# EAGLE schematic MagBase (EAGLE 7.1.0)
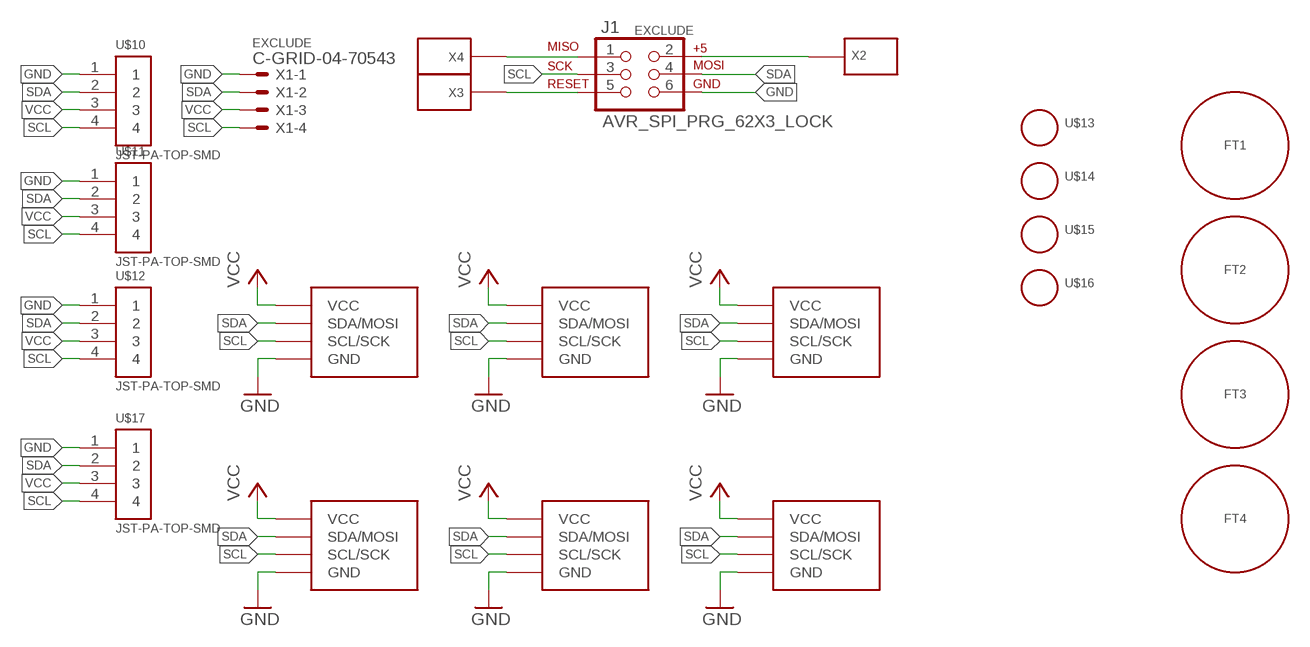
[diagram p0: schematic, sheet 1]

## Parts
FT1  FOOT  [FOOT]
FT2  FOOT  [FOOT]
FT3  FOOT  [FOOT]
FT4  FOOT  [FOOT]
J1  AVR_SPI_PRG_62X3_LOCK  [2X3_LOCK]
U$1  MAGBASE  [MAGBASE]
U$2  MAGBASE  [MAGBASE]
U$3  MAGBASE  [MAGBASE]
U$4  MAGBASE  [MAGBASE]
U$5  MAGBASE  [MAGBASE]
U$6  MAGBASE  [MAGBASE]
U$10  JST-PA-TOP-SMD  [JST-PA-TOP-SMD]
U$11  JST-PA-TOP-SMD  [JST-PA-TOP-SMD]
U$12  JST-PA-TOP-SMD  [JST-PA-TOP-SMD]
U$13  HOLE#4  [HOLE-#4]
U$14  HOLE#4  [HOLE-#4]
U$15  HOLE#4  [HOLE-#4]
U$16  HOLE#4  [HOLE-#4]
U$17  JST-PA-TOP-SMD  [JST-PA-TOP-SMD]
X1  C-GRID-04-70543  [70543-04]
X2  SPRING-CONTACT  [SPRING-CONTACT]
X3  SPRING-CONTACT  [SPRING-CONTACT]
X4  SPRING-CONTACT  [SPRING-CONTACT]

## Nets
GND: J1.6 U$1.GNDA(GND) U$1.GNDB(GND) U$2.GNDA(GND) U$2.GNDB(GND) U$3.GNDA(GND) U$3.GNDB(GND) U$4.GNDA(GND) U$4.GNDB(GND) U$5.GNDA(GND) U$5.GNDB(GND) U$6.GNDA(GND) U$6.GNDB(GND) U$10.1 U$11.1 U$12.1 U$17.1 X1.1
N$1: J1.1 X4.P$1
N$2: J1.5 X3.P$1
N$3: J1.2 X2.P$1
SCL: J1.3 U$1.SCLA(SCL/SCK) U$1.SCLB(SCL/SCK) U$2.SCLA(SCL/SCK) U$2.SCLB(SCL/SCK) U$3.SCLA(SCL/SCK) U$3.SCLB(SCL/SCK) U$4.SCLA(SCL/SCK) U$4.SCLB(SCL/SCK) U$5.SCLA(SCL/SCK) U$5.SCLB(SCL/SCK) U$6.SCLA(SCL/SCK) U$6.SCLB(SCL/SCK) U$10.4 U$11.4 U$12.4 U$17.4 X1.4
SDA: J1.4 U$1.SDAA(SDA/MOSI) U$1.SDAB(SDA/MOSI) U$2.SDAA(SDA/MOSI) U$2.SDAB(SDA/MOSI) U$3.SDAA(SDA/MOSI) U$3.SDAB(SDA/MOSI) U$4.SDAA(SDA/MOSI) U$4.SDAB(SDA/MOSI) U$5.SDAA(SDA/MOSI) U$5.SDAB(SDA/MOSI) U$6.SDAA(SDA/MOSI) U$6.SDAB(SDA/MOSI) U$10.2 U$11.2 U$12.2 U$17.2 X1.2
VCC: U$1.VCCA(VCC) U$1.VCCB(VCC) U$2.VCCA(VCC) U$2.VCCB(VCC) U$3.VCCA(VCC) U$3.VCCB(VCC) U$4.VCCA(VCC) U$4.VCCB(VCC) U$5.VCCA(VCC) U$5.VCCB(VCC) U$6.VCCA(VCC) U$6.VCCB(VCC) U$10.3 U$11.3 U$12.3 U$17.3 X1.3
Unconnected: U$13.P$1(HOLE) U$14.P$1(HOLE) U$15.P$1(HOLE) U$16.P$1(HOLE)

## Library data of the parts
FT1-FT4 = Modulo:FOOT; PARTNUM: SJ6553
J1 = SparkFun-Connectors:AVR_SPI_PRG_6: AVR ISP 6 Pin This is the reduced ISP connector for AVR programming. Common on Arduino. This footprint will take up less PCB space and can be used with a 10-pin to 6-pin adapter such as SKU: BOB-08508; PARTNUM: EXCLUDE
U$1-U$6 = Modulo:MAGBASE; PARTNUM: EXCLUDE
U$10-U$12 U$17 = Modulo:JST-PA; PARTNUM: BM04B-PASS-1-TFT(LF)(SN)
U$13-U$16 = Modulo:HOLE; PARTNUM: EXCLUDE
X1 = con-molex:C-GRID-04: CONNECTOR wire to board 2.54 mm (0.100") pitch header; OC_FARNELL: unknown; OC_NEWARK: unknown; PARTNUM: EXCLUDE
X2-X4 = Modulo:SPRING-CONTACT; PARTNUM: 120220-0314